# EAGLE design Mutatio_REV1 (EAGLE 7.2.0)
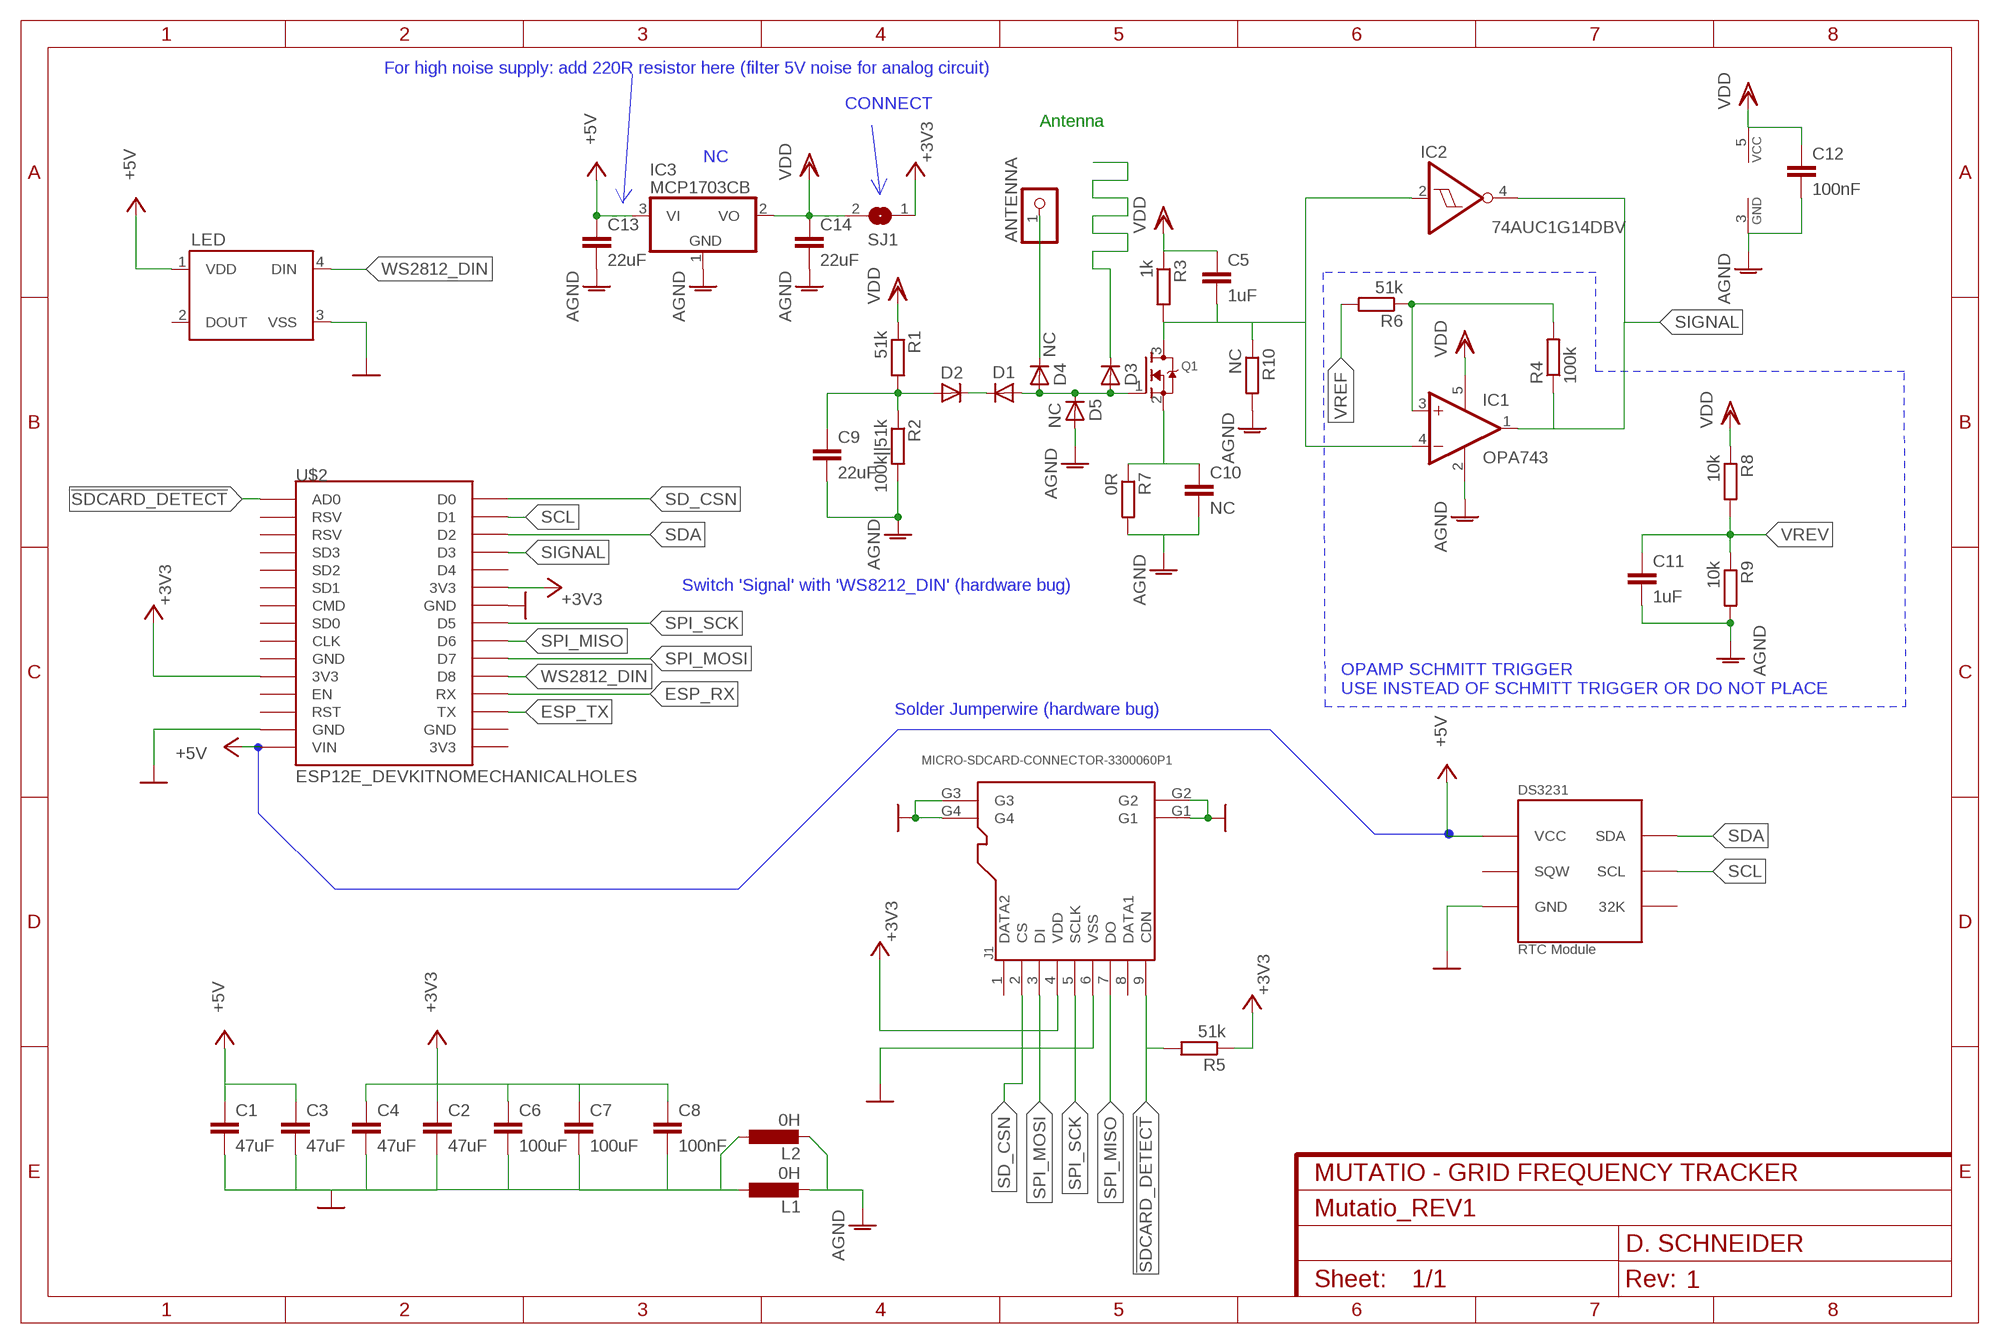
[diagram p0: schematic, sheet 1]
FRAME (FRAME-A4L): CNAME: MUTATIO - GRID FREQUENCY TRACKER; CREVISION: 1; DESIGNER: D. SCHNEIDER

## Parts
ANTENNA  PINHD-1X1CB  [1X01-CLEANBIG]
C1  47uF  C-EUC0805  [C0805]
C2  47uF  C-EUC0805  [C0805]
C3  47uF  C-EUC0805  [C0805]
C4  47uF  C-EUC0805  [C0805]
C5  1uF  C-EUC0603  [C0603]
C6  100uF  C-EUC1206  [C1206]
C7  100uF  C-EUC1206  [C1206]
C8  100nF  C-EUC0603  [C0603]
C9  22uF  C-EUC0603  [C0603]
C10  NC  C-EUC0603  [C0603]
C11  1uF  C-EUC0603  [C0603]
C12  100nF  C-EUC0603  [C0603]
C13  22uF  C-EUC0603  [C0603]
C14  22uF  C-EUC0603  [C0603]
D1  DIODE-MINIMELF  [MINIMELF]
D2  DIODE-MINIMELF  [MINIMELF]
D3  DIODE-MINIMELF  [MINIMELF]
D4  NC  DIODE-MINIMELF  [MINIMELF]
D5  NC  DIODE-MINIMELF  [MINIMELF]
IC1  OPA743  [SOT23-5]
IC2  74AUC1G14DBV  [SOT23-5]
IC3  MCP1703CB  [SOT23]
J1  MICRO-SDCARD-CONNECTOR-3300060P1  [9P-SMD-W-RING]
L1  0H  L-EUL2012C  [L2012C]
L2  0H  L-EUL2012C  [L2012C]
LED  WS2812B  [WS2812B]
Q1  MOSFET-NREFLOW  [SOT23]
R1  51k  R-EU_R0603  [R0603]
R2  100k||51k  R-EU_R0603  [R0603]
R3  1k  R-EU_R0603  [R0603]
R4  100k  R-EU_R0603  [R0603]
R5  51k  R-EU_R0603  [R0603]
R6  51k  R-EU_R0603  [R0603]
R7  0R  R-EU_R0603  [R0603]
R8  10k  R-EU_R0603  [R0603]
R9  10k  R-EU_R0603  [R0603]
R10  NC  R-EU_R0603  [R0603]
SJ1  SJ  [SJ]
U$1  DS3231_MODULEBIG_CONNECTER_ONLY  [DS3231_MODULE_BIGCON]
U$2  ESP12E_DEVKITNOMECHANICALHOLES  [ESP12E_DEVKIT_NOHOLES]

## Nets
!SDCARD_DETECT: J1.9(CDN) R5.2 U$2.AD0
+3V3: C2.1 C4.1 C6.1 C7.1 C8.1 J1.4(VDD) R5.1 SJ1.1 U$2.3V3@0(3V3) U$2.3V3@1(3V3)
+5V: C1.1 C3.1 C13.1 IC3.3(VI) LED.1(VDD) U$1.VCC@2(VCC) U$2.VIN
AGND: C9.2 C10.2 C11.2 C12.2 C13.2 C14.2 D5.A IC1.2(V-) IC2.3(GND) IC3.1(GND) L1.2 L2.2 R2.2 R7.2 R9.2 R10.2
ANTENNA: D1.A D3.A D4.A D5.C Q1.1(G)
BOARDANTENNA: D3.C
ESP_RX: U$2.RX
ESP_TX: U$2.TX
GND: C1.2 C2.2 C3.2 C4.2 C6.2 C7.2 C8.2 J1.6(VSS) J1.G1 J1.G2 J1.G3 J1.G4 L1.1 L2.1 LED.3(VSS) U$1.GND@2(GND) U$2.GND@1(GND) U$2.GND@2(GND)
N$1: D1.C D2.C
N$2: C10.1 Q1.2(S) R7.1
N$3: ANTENNA.1 D4.C
N$4: C5.2 IC1.4(-IN) IC2.2(I) Q1.3(D) R3.2 R10.1
N$7: IC1.3(+IN) R4.2 R6.1
REV1: C9.1 D2.A R1.2 R2.1
SCL: U$1.SCL@2(SCL) U$2.D1
SD_CSN: J1.2(CS) U$2.D0
SDA: U$1.SDA@2(SDA) U$2.D2
SIGNAL: IC1.1(OUT) IC2.4(O) R4.1 U$2.D3
SPI_MISO: J1.7(DO) U$2.D6
SPI_MOSI: J1.3(DI) U$2.D7
SPI_SCK: J1.5(SCLK) U$2.D5
VDD: C5.1 C12.1 C14.1 IC1.5(V+) IC2.5(VCC) IC3.2(VO) R1.1 R3.1 R8.1 SJ1.2
VREF: R6.2
VREV: C11.1 R8.2 R9.1
WS2812_DIN: LED.4(DIN) U$2.D8
Unconnected: J1.1(DATA2) J1.8(DATA1) LED.2(DOUT) U$1.32K U$1.SQW U$2.3V3@2(3V3) U$2.CLK U$2.CMD U$2.D4 U$2.EN U$2.GND@0(GND) U$2.GND@3(GND) U$2.RST U$2.RSV@0(RSV) U$2.RSV@1(RSV) U$2.SD0 U$2.SD1 U$2.SD2 U$2.SD3

## Notes on the sheet
- For high noise supply: add 220R resistor here (filter 5V noise for analog circuit)
- CONNECT
- Antenna
- NC
- Switch 'Signal' with 'WS8212_DIN' (hardware bug)
- OPAMP SCHMITT TRIGGER
  USE INSTEAD OF SCHMITT TRIGGER OR DO NOT PLACE
- Solder Jumperwire (hardware bug)

## Library data of the parts
ANTENNA = adafruit:PINHD-1X1: Pin header 1x1 for 0.1" spacing With round pins
C1-C14 = resistor:C-EU: CAPACITOR, European symbol
D1-D5 = diode:DIODE-: DIODE
IC1 = linear:OPA743: 12V, 7MHz, CMOS, Rail-to-Rail I/O OP AMP Source: http://focus.ti.com/lit/ds/sbos201/sbos201.pdf
IC2 = 74xx-little-de:74*1G14: Single Schmitt-Trigger Inverter Gate
IC3 = linear:MCP1703: 250 mA, 16V, Low Quiescent Current LDO Regulator Source: http://ww1.microchip.com/downloads/en/DeviceDoc/22049b.pdf
J1 = OPL Eagle Library:MICRO-SDCARD-CONNECTOR: Micro SD Card
L1 L2 = resistor:L-EU: INDUCTOR, European symbol
LED = SparkFun-LED:WS2812B: WS2812B - Intelligent control LED integrated light source Technical Specifications: Power Supply Voltage (VDD): 3.5 to 5.3 V Input Voltage (VI): -0.5 to VDD+0.5 V Operating Junction Temperature (Topt): -25°C to +80°C Storage Temperature Range (Tstg): -55°C to +150°C
Q1 = adafruit:MOSFET-N: N-Channel Mosfet 2N7002E - 60V 260mA SOT23 [Digikey: 2N7002ET1GOSTR-ND] - REEL BSH103 - 30V 850mA SOT23 [Digikey: 568-5013-1-ND]
R1-R10 = resistor:R-EU_: RESISTOR, European symbol
SJ1 = jumper:SJ: SMD solder JUMPER
U$1 = DS3231_Module:DS3231_MODULE
U$2 = NODEMCU_ESP12E_DEVKIT:ESP12E_DEVKIT: ESP12E DEVKIT BOARD

## Board
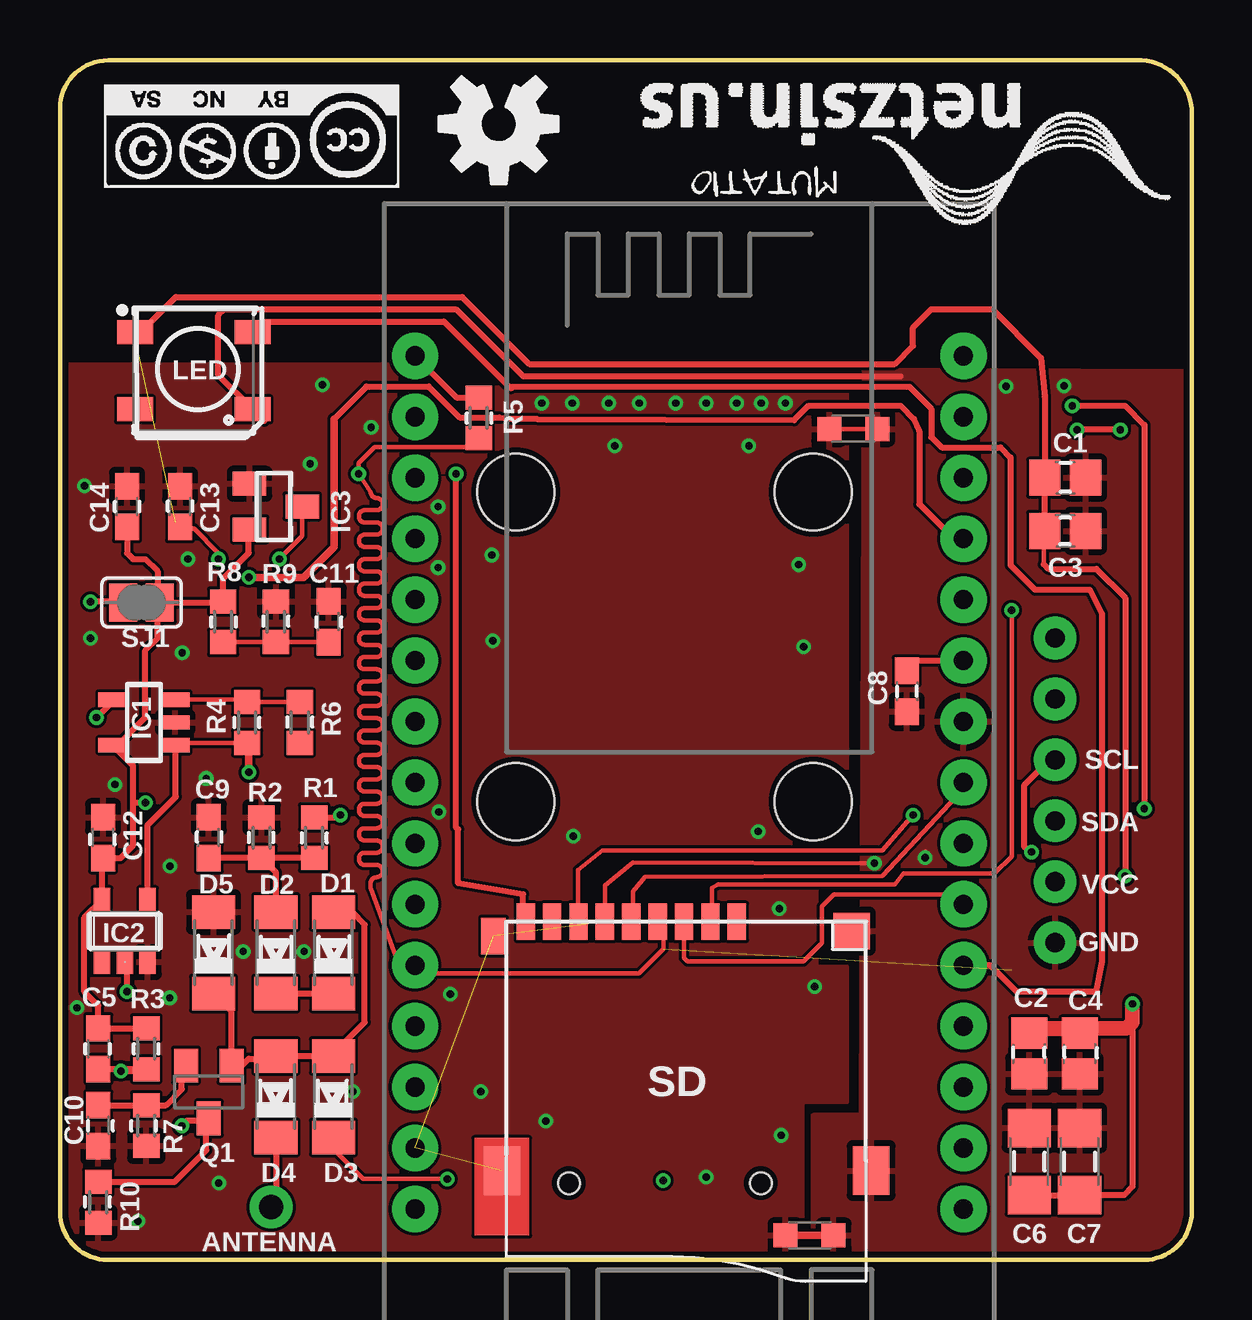
[diagram p1: board, top side]
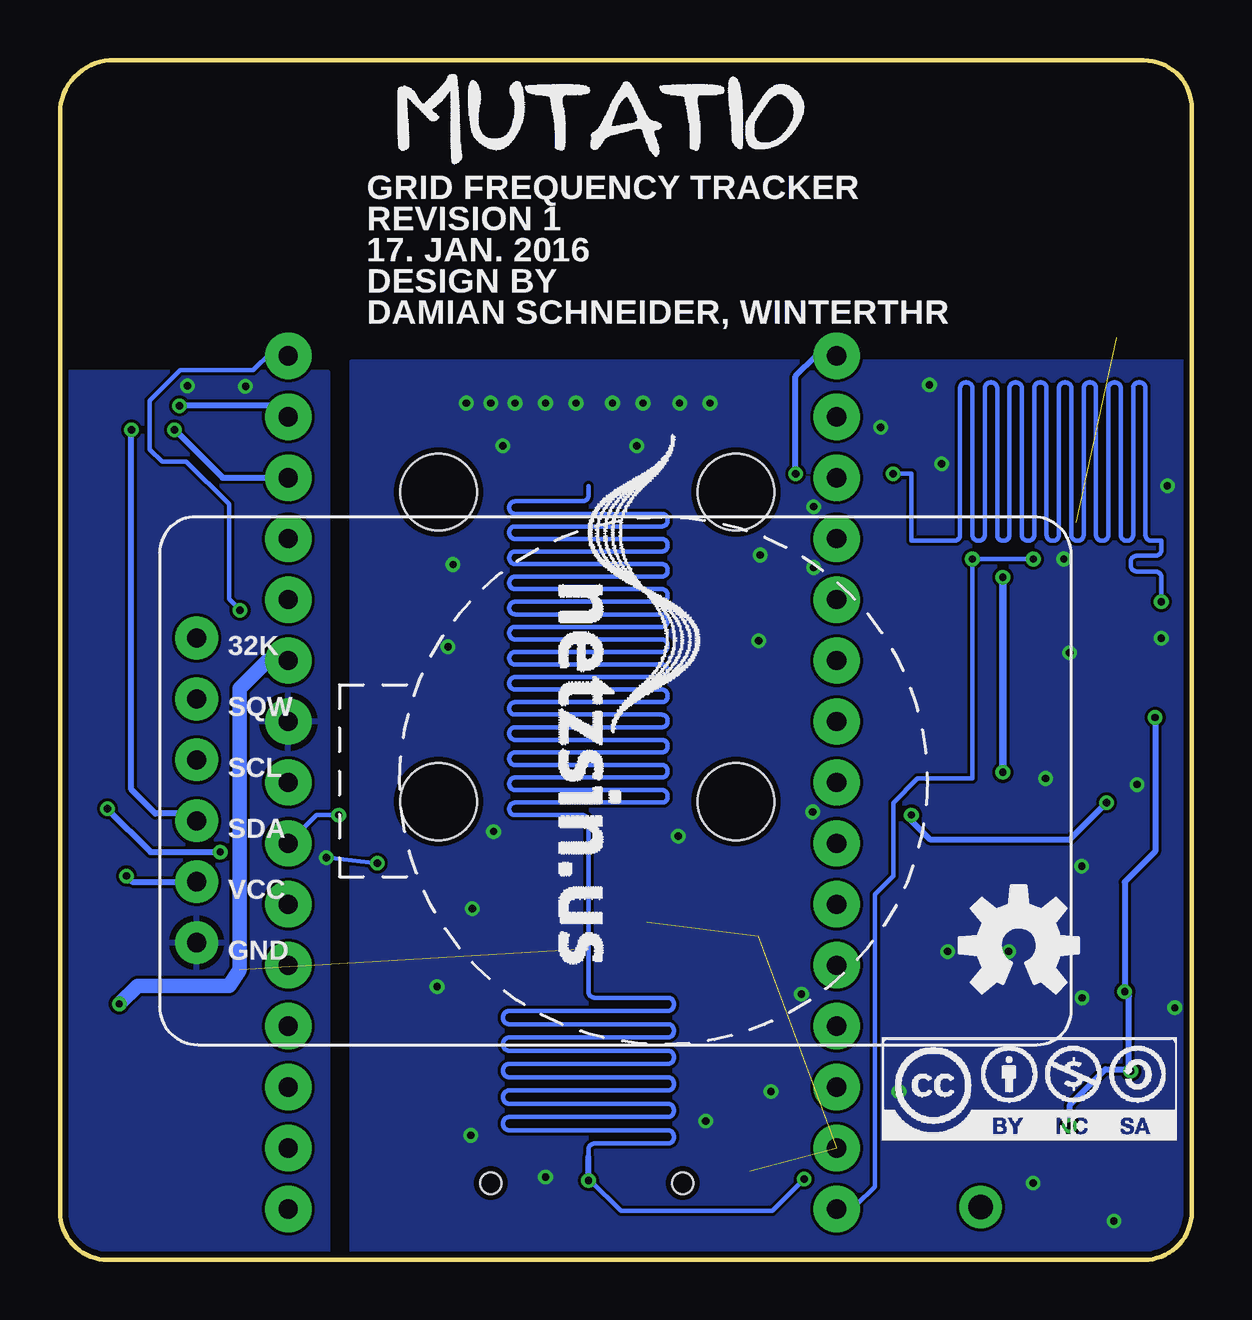
[diagram p2: board, bottom side, seen from below]

Size 47.18 x 50.01 mm. Coordinates in mm from the lower left corner, seen from the top.
Outline: 47.18,2 47.18,48 arc90 44.68,50 2,50 arc90 0,48 0,2 arc90 2,0 45.18,0 arc90 47.18,2
Copper layers (1*16): Top 0.035mm / dielectric 1.5mm / Bottom 0.035mm
Design rules "dirt_cheap_dirty_boards.v1": minimum track width 5mil, minimum drill 12mil, track to track 5mil, track to pad 5mil, pad to pad 5mil, via to via 5mil, smd to smd 0mil, copper to edge 10mil, drill to drill 10mil, minimum pad ring 10mil, minimum via ring 6mil, stop-mask expansion 2mil, vias tented up to drill 25mil, thermal gap 10mil
Holes 3.2 mm at 19,32 31.4,32 31.4,19.1 19,19.1

### Footprints (pad centres in the part's own frame; a part is rotated, then mirrored left to right if it is on the bottom)
1X01-CLEANBIG = drill 1.016 pad 1.778: 1 0,0
C0805 = smd 1.3 x 1.5: 1 -0.85,0; 2 0.85,0
C0603 = smd 1.1 x 1: 1 -0.85,0; 2 0.85,0
C1206 = smd 1.6 x 1.8: 1 -1.4,0; 2 1.4,0
MINIMELF = smd 1.4 x 1.8: A 1.7,0; C -1.7,0
SOT23-5 = smd 0.6 x 1.2: 1 -0.95,-1.306; 2 0,-1.306; 3 0.95,-1.306; 4 0.95,1.306; 5 -0.95,1.306
SOT23-5' = smd 0.69 x 0.99: 1 -0.95,-1.29; 2 0,-1.29; 3 0.95,-1.29; 4 0.95,1.3; 5 -0.95,1.3
SOT23 = smd 1 x 1.4: 1 -0.95,-1.1; 2 0.95,-1.1; 3 0,1.1
9P-SMD-W-RING = smd 1.524 x 0.762: 1 -7.493,2.114; 2 -7.493,1.014; 3 -7.493,-0.086; 4 -7.493,-1.186; 5 -7.493,-2.286; 6 -7.493,-3.386; 7 -7.493,-4.486; 8 -7.493,-5.586; 9 -7.493,-6.686 | smd 1.524 x 1.016: G1 -6.893,-8.032 | smd 2.032 x 1.524: G2 2.88,-7.686; G3 2.88,7.714 | smd 1.524 x 1.524: G4 -7.101,6.895 | hole 0.889: 3.407,-4.886; 3.407,3.114
L2012C = smd 1 x 1: 1 -1,0; 2 1,0
WS2812B = smd 1.5 x 1: 1 -2.45,1.6; 2 -2.45,-1.6; 3 2.45,-1.6; 4 2.45,1.6
R0603 = smd 1 x 1.1: 1 -0.85,0; 2 0.85,0
SJ = smd 1.168 x 1.6: 1 -0.762,0; 2 0.762,0
DS3231_MODULE_BIGCON = drill 0.8 pad 1.778: 32K 5.52,18.68; GND@2 -7.18,18.68; SCL@2 0.44,18.68; SDA@2 -2.1,18.68; SQW 2.98,18.68; VCC@2 -4.64,18.68
ESP12E_DEVKIT_NOHOLES = drill 0.8 pad 1.93: 3V3@0 -11.43,-7.62; 3V3@1 11.43,5.08; 3V3@2 11.43,-17.78; AD0 -11.43,17.78; CLK -11.43,-2.54; CMD -11.43,2.54; D0 11.43,17.78; D1 11.43,15.24; D2 11.43,12.7; D3 11.43,10.16; D4 11.43,7.62; D5 11.43,0; D6 11.43,-2.54; D7 11.43,-5.08; D8 11.43,-7.62; EN -11.43,-10.16; GND@0 -11.43,-5.08; GND@1 -11.43,-15.24; GND@2 11.43,2.54; GND@3 11.43,-15.24; RST -11.43,-12.7; RSV@0 -11.43,15.24; RSV@1 -11.43,12.7; RX 11.43,-10.16; SD0 -11.43,0; SD1 -11.43,5.08; SD2 -11.43,7.62; SD3 -11.43,10.16; TX 11.43,-12.7; VIN -11.43,-17.78

### Placement (x,y rotation side)
ANTENNA  8.8,2.2 0 top
C1  41.9,32.6 0 top
C2  40.4,8.6 270 top
C3  41.9,30.38 0 top
C4  42.5,8.6 270 top
C5  1.6,8.8 270 top
C6  40.4,4.1 90 top
C7  42.5,4.1 90 top
C8  35.3,23.7 270 top
C9  6.2,17.6 90 top
C10  1.6,5.6 270 top
C11  11.2,26.6 90 top
C12  1.8,17.6 90 top
C13  5,31.4 90 top
C14  2.8,31.4 90 top
D1  11.4,12.8 90 top
D2  9,12.8 90 top
D3  11.4,6.8 90 top
D4  9,6.8 90 top
D5  6.4,12.8 90 top
IC1  3.5,22.4 90 top
IC2  74AUC1G14DBV  [SOT23-5']  2.7,13.7 0 top
IC3  9,31.4 270 top
J1  26.1,6.6 270 top
L1  33.07,34.64 180 top
L2  31.24,1.02 180 top
LED  5.58,37.06 0 top
Q1  6.2,7 180 top
R1  10.6,17.6 270 top
R2  8.4,17.6 90 top
R3  3.6,8.8 270 top
R4  7.8,22.4 90 top
R5  17.45,35.1 90 top
R6  10,22.4 270 top
R7  3.6,5.6 270 top
R8  6.8,26.6 270 top
R9  9,26.6 90 top
R10  1.6,2.4 270 top
SJ1  3.4,27.4 0 top
U$1  22.8,20.4 90 bottom
U$2  26.23,19.9 0 top
U$3  [OSHW-LOGO-M]  18.29,47.35 180 top
U$4  [CC-BY-NC-SA]  14.12,48.97 180 top
U$5  [CC-BY-NC-SA]  12.9,4.99 0 bottom
U$6  [OSHW-LOGO-M]  7.21,13.11 0 bottom

### Tracks (layer width: path | path; a pad name or v marks a point on that pad's centre or on a via)
!SDCARD_DETECT  (via drill 0.3)
  Top 0.178: 14.89,37.59 U$2.AD0
  Top 0.254: 14.89,37.59 16.53,35.95 R5.2 | J1.9 19.3,14.2 19.3,15.24 16.6,15.7 16.6,17.94 16.51,18.03 v16.51,32.77
  Bottom 0.254: v16.51,32.77 16.51,36.83 15.66,37.68 U$2.AD0
+3V3  (via drill 0.3)  (1 unrouted)
  Top 0.178: U$2.3V3@0 14.8,11.94 24.13,11.94 25.15,12.95 25.15,13.86 J1.4 | U$2.3V3@0 15.07,12.28 | U$2.3V3@0 14.14,12.28 12.95,15.49 12.95,15.7 arc-90 13.2,15.95 arc90 13.45,16.2 13.45,16.21 arc90 13.2,16.46 12.71,16.46 arc-90 12.46,16.71 12.46,16.72 arc-90 12.71,16.97 13.2,16.97 arc90 13.45,17.22 13.45,17.23 arc90 13.2,17.48 12.71,17.48 arc-90 12.46,17.73 12.46,17.74 arc-90 12.71,17.99 13.2,17.99 arc90 13.45,18.24 13.45,18.25 arc90 13.2,18.5 12.71,18.5 arc-90 12.46,18.75 12.46,18.76 arc-90 12.71,19.01 13.2,19.01 arc90 13.45,19.26 13.45,19.27 arc90 13.2,19.52 12.71,19.52 arc-90 12.46,19.77 12.46,19.78 arc-90 12.71,20.03 13.2,20.03 arc90 13.45,20.28 13.45,20.29 arc90 13.2,20.54 12.71,20.54 arc-90 12.46,20.79 12.46,20.8 arc-90 12.71,21.05 13.2,21.05 arc90 13.45,21.3 13.45,21.31 arc90 13.2,21.56 12.71,21.56 arc-90 12.46,21.81 12.46,21.82 arc-90 12.71,22.07 13.2,22.07 arc90 13.45,22.32 13.45,22.33 arc90 13.2,22.58 12.71,22.58 arc-90 12.46,22.83 12.46,22.84 arc-90 12.71,23.09 13.2,23.09 arc90 13.45,23.34 13.45,23.35 arc90 13.2,23.6 12.71,23.6 arc-90 12.46,23.85 12.46,23.86 arc-90 12.71,24.11 13.2,24.11 arc90 13.45,24.36 13.45,24.37 arc90 13.2,24.62 12.71,24.62 arc-90 12.46,24.87 12.46,24.88 arc-90 12.71,25.13 13.2,25.13 arc90 13.45,25.38 13.45,25.39 arc90 13.2,25.64 12.71,25.64 arc-90 12.46,25.89 12.46,25.9 arc-90 12.71,26.15 13.2,26.15 arc90 13.45,26.4 13.45,26.41 arc90 13.2,26.66 12.71,26.66 arc-90 12.46,26.91 12.46,26.92 arc-90 12.71,27.17 13.2,27.17 arc90 13.45,27.41 13.45,27.43 arc90 13.2,27.68 12.71,27.68 arc-90 12.46,27.93 12.46,27.94 arc-90 12.71,28.19 13.2,28.19 arc90 13.45,28.43 13.45,28.45 arc90 13.2,28.7 12.71,28.7 arc-90 12.46,28.95 12.46,28.96 arc-90 12.71,29.21 13.2,29.21 arc90 13.45,29.45 13.45,29.47 arc90 13.2,29.72 12.71,29.72 arc-90 12.46,29.96 12.46,29.98 arc-90 12.71,30.23 13.2,30.23 arc90 13.45,30.47 13.45,30.49 arc90 13.2,30.74 12.71,30.74 arc-90 12.46,30.98 12.46,31 arc-90 12.71,31.25 13.2,31.25 arc90 13.45,31.49 13.45,31.51 arc90 13.2,31.76 arc-90 12.95,32 v12.45,32.77 12.45,33.21 13.12,33.88 17.08,33.88 R5.1
  Top 0.254: SJ1.1 2.64,27.43 v1.27,27.43 | 42.7,9.65 C4.1 C2.1 40.6,9.65 42.7,9.65 | 42.7,9.65 44.45,9.65 44.7,9.65 44.7,3.05 44.36,2.7 C7.1 C6.1 | C8.1 35.73,24.98 U$2.3V3@1
  Top 0.61: 40.6,9.65 44.45,9.65 44.7,9.91 v44.7,10.67
  Bottom 0.178: v1.27,27.43 1.27,28.45 arc-90 1.52,28.7 2.29,28.7 arc90 2.54,28.94 2.54,29.1 arc90 2.29,29.35 1.52,29.35 arc-90 1.27,29.6 1.27,29.97 1.68,29.97 arc90 1.93,30.22 1.93,36.33 arc-90 2.18,36.58 2.2,36.58 arc-90 2.44,36.33 2.44,30.22 arc90 2.69,29.97 2.71,29.97 arc90 2.96,30.22 2.96,36.33 arc-90 3.21,36.58 3.23,36.58 arc-90 3.47,36.33 3.47,30.22 arc90 3.72,29.97 3.74,29.97 arc90 3.99,30.22 3.99,36.33 arc-90 4.24,36.58 4.26,36.58 arc-90 4.5,36.33 4.5,30.22 arc90 4.75,29.97 4.77,29.97 arc90 5.02,30.22 5.02,36.33 arc-90 5.27,36.58 5.29,36.58 arc-90 5.54,36.33 5.54,30.22 arc90 5.78,29.97 5.8,29.97 arc90 6.05,30.22 6.05,36.33 arc-90 6.3,36.58 6.32,36.58 arc-90 6.57,36.33 6.57,30.22 arc90 6.81,29.97 6.83,29.97 arc90 7.08,30.22 7.08,36.33 arc-90 7.33,36.58 7.35,36.58 arc-90 7.6,36.33 7.6,30.22 arc90 7.84,29.97 7.87,29.97 arc90 8.11,30.22 8.11,36.33 arc-90 8.36,36.58 8.38,36.58 arc-90 8.63,36.33 8.63,30.22 arc90 8.88,29.97 8.89,29.97 arc90 9.14,30.22 9.14,36.33 arc-90 9.39,36.58 9.41,36.58 arc-90 9.66,36.33 9.66,30.22 arc90 9.91,29.97 11.68,29.97 11.68,32.77 v12.45,32.77
  Bottom 0.61: v44.7,10.67 43.94,11.43 40.13,11.43 39.68,12.08 39.68,23.82 38.52,24.98 U$2.3V3@1
+5V  (via drill 0.3)  (1 unrouted)
  Top 0.178: IC3.3 10.1,30.17 v9.14,29.21 | v6.6,29.21 6.6,29.46 5.59,30.48 5.07,30.48 C13.1 | C3.1 41,30.33 41,29
  Top 0.254: 4.82,30.73 C13.1 | 3.5,38.66 LED.1 3.13,38.44 4.83,40.13 16.76,40.13 19.56,37.34 34.8,37.34 35.56,38.1 35.56,38.86 36.32,39.62 38.86,39.62 40.89,37.59 41.05,35.97 C1.1 C3.1 | 41,29 41.2,28.8 43.2,28.8 44.4,27.6 v44.4,16
  Bottom 0.178: v6.6,29.21 v9.14,29.21 9.14,20.07 11.43,20.07 12.45,19.05 12.45,16 13.21,15.24 13.21,3.05 13.97,2.29 14.63,2.29 U$2.VIN
  Bottom 0.254: v44.4,16 44.16,15.76 U$1.VCC@2
AGND  (via drill 0.3)
  other vias: 5.33,29.21 1.27,25.91 2.29,19.81 6.1,20.07 4.57,10.92 0.71,10.51 1.02,32.26 3.25,1.62 20.08,35.71 21.35,35.71 22.87,35.71 24.14,35.71 25.67,35.71 26.94,35.71 28.21,35.71 29.22,35.71 30.24,35.71 16.27,11.08 18.05,25.81 23.13,33.94 28.72,33.94 30.79,28.98 31,25.55 29.99,14.63 17.99,29.38 15.76,31.4 15.76,28.86 12.97,34.7 10.94,36.48 10.43,33.17 10.17,12.85 7.63,12.85 4.59,16.41 5.09,25.3 6.62,3.2 12.21,7.01 17.54,7.01 26.94,3.46 31.46,11.39 15.8,18.67 30.06,5.19 20.26,5.79 29.1,17.85 21.4,17.65
  pour Top: 0.2,37.3 30.9,37.3 32.51,37.34 32.77,37.34 32.77,17.78 31.5,17.78 31.5,12.19 32.77,12.19 32.77,6.6 30.9,6.6 30.9,0 0,0
  pour Bottom: 0,37.4 35,37.4 35,0 0,0
ANTENNA
  Top 0.254: D1.A 11.42,14.48 12.19,14.48 12.7,13.97 12.7,9.91 11.4,8.61 D3.A D4.A 8.88,8.38 7.87,8.38 7.59,8.1 Q1.1 7.15,10.35 D5.C
BOARDANTENNA  (via drill 0.3)
  Top 0.178: D3.C 11.4,4.6 12.63,3.37 v16.15,3.37
  Bottom 0.178: 25.15,32.26 25.15,31.87 arc90 25.39,31.62 28.2,31.62 arc-90 28.45,31.37 28.45,31.34 arc-90 28.2,31.09 22.09,31.09 arc90 21.84,30.85 21.84,30.82 arc90 22.09,30.57 28.2,30.57 arc-90 28.45,30.32 28.45,30.3 arc-90 28.2,30.05 22.09,30.05 arc90 21.84,29.8 21.84,29.77 arc90 22.09,29.52 28.2,29.52 arc-90 28.45,29.28 28.45,29.25 arc-90 28.2,29 22.09,29 arc90 21.84,28.75 21.84,28.73 arc90 22.09,28.48 28.2,28.48 arc-90 28.45,28.23 28.45,28.2 arc-90 28.2,27.95 22.09,27.95 arc90 21.84,27.71 21.84,27.68 arc90 22.09,27.43 28.2,27.43 arc-90 28.45,27.18 28.45,27.16 arc-90 28.2,26.91 22.09,26.91 arc90 21.84,26.66 21.84,26.63 arc90 22.09,26.39 28.2,26.39 arc-90 28.45,26.14 28.45,26.11 arc-90 28.2,25.86 22.09,25.86 arc90 21.84,25.61 21.84,25.59 arc90 22.09,25.34 28.2,25.34 arc-90 28.45,25.09 28.45,25.06 arc-90 28.2,24.82 22.09,24.82 arc90 21.84,24.57 21.84,24.54 arc90 22.09,24.29 28.2,24.29 arc-90 28.45,24.05 28.45,24.02 arc-90 28.2,23.77 22.09,23.77 arc90 21.84,23.52 21.84,23.49 arc90 22.09,23.25 28.2,23.25 arc-90 28.45,23 28.45,22.97 arc-90 28.2,22.72 22.09,22.72 arc90 21.84,22.48 21.84,22.45 arc90 22.09,22.2 28.2,22.2 arc-90 28.45,21.95 28.45,21.92 arc-90 28.2,21.68 22.09,21.68 arc90 21.84,21.43 21.84,21.4 arc90 22.09,21.15 28.2,21.15 arc-90 28.45,20.91 28.45,20.88 arc-90 28.2,20.63 22.09,20.63 arc90 21.84,20.38 21.84,20.35 arc90 22.09,20.11 28.2,20.11 arc-90 28.45,19.86 28.45,19.83 arc-90 28.2,19.58 22.09,19.58 arc90 21.84,19.34 21.84,19.31 arc90 22.09,19.06 28.2,19.06 arc-90 28.45,18.81 28.45,18.78 arc-90 28.2,18.54 25.39,18.54 arc90 25.15,18.29 25.15,11.18 arc-90 24.9,10.93 21.84,10.93 arc90 21.59,10.68 21.59,10.62 arc90 21.84,10.38 28.45,10.38 arc-90 28.7,10.13 28.7,10.07 arc-90 28.45,9.82 21.84,9.82 arc90 21.59,9.57 21.59,9.52 arc90 21.84,9.27 28.45,9.27 arc-90 28.7,9.02 28.7,8.96 arc-90 28.45,8.72 21.84,8.72 arc90 21.59,8.47 21.59,8.41 arc90 21.84,8.16 28.45,8.16 arc-90 28.7,7.92 28.7,7.86 arc-90 28.45,7.61 21.84,7.61 arc90 21.59,7.36 21.59,7.31 arc90 21.84,7.06 28.45,7.06 arc-90 28.7,6.81 28.7,6.75 arc-90 28.45,6.51 21.84,6.51 arc90 21.59,6.26 21.59,6.2 arc90 21.84,5.95 28.45,5.95 arc-90 28.7,5.71 28.7,5.65 arc-90 28.45,5.4 21.84,5.4 arc90 21.59,5.15 21.59,5.1 arc90 21.84,4.85 24.9,4.85 arc-90 25.15,4.6 25.15,4.28
  Bottom 0.178: v16.15,3.37 17.47,2.05 23.8,2.05 25.05,3.3 v25.15,3.3
  Bottom 0.254: v25.15,3.3 25.15,4.28
GND  (via drill 0.3)  (3 unrouted)
  Top 0.178: J1.6 22.71,15.6 23.88,16.56 v33.95,16.53 | v36.07,16.76 36.07,17.02
  Top 0.254: 8.52,34.97 LED.3 6.6,36.89 6.6,39.37 6.86,39.62 16.51,39.62 19.3,36.83 35.05,36.83
  Bottom 0.178: v33.95,16.53 v36.07,16.76
  other vias: 39.44,36.41 41.86,36.43
  pour Top: 31.4,6 31.4,0 47,0 47,37 33.54,37.06 33.4,6
  pour Bottom: 36,37 36,0 47,0 47,37
N$1
  Top 0.254: D2.C D1.C
N$2
  Top 0.254: C10.1 R7.1 4.42,6.45 5.08,7.11 5.08,7.93 Q1.2
N$3
  Top 0.254: D4.C 9,2.4 ANTENNA.1
N$4  (via drill 0.3)
  Top 0.254: R10.1 4.77,3.25 6.1,4.57 6.1,5.8 | 6.1,5.8 Q1.3 | 6.1,5.8 5.29,5.8 v5.08,5.59 | v2.54,7.87 3.52,7.87 R3.2 C5.2 | v2.79,11.18 2.79,12.32 IC2.2 | IC1.4 2.19,23.28 v1.52,22.61
  Bottom 0.254: v5.08,5.59 5.08,6.47 R3.2 2.62,7.95 | 2.62,7.95 v2.54,7.87 | 2.62,7.95 2.62,11 v2.79,11.18 2.79,15.75 1.52,17.02 v1.52,22.61
N$6
  Top 0.178: 32.26,34.64 34.04,34.64
N$7
  Top 0.178: R6.1 R4.2 7.7,23.35 IC1.3
N$8
  Top 0.305: 30.48,1.02 32,1.02
REV1
  Top 0.254: D2.A 9,16.15 R2.1 | R2.1 C9.1 | R1.2 R2.1
SCL  (via drill 0.3)
  Top 0.254: v42.2,35.6 44.4,35.6 45.2,34.8 v45.2,18.8 | v40.5,17 40.2,17.2 40.2,19.8 41.24,20.84 U$1.SCL@2
  Bottom 0.254: U$2.D1 38.12,35.6 v42.2,35.6 | v45.2,18.8 43.4,17 v40.5,17
SD_CSN  (via drill 0.3)
  Top 0.178: J1.2 27.18,14.16 27.18,15.49 27.43,15.65 34.8,15.65 35.15,16.1 38.95,16.1 39.67,16.82 v39.67,27.08
  Bottom 0.178: v39.67,27.08 40.13,27.54 40.13,31.5 41.91,33.27 42.93,33.27 43.43,33.78 43.43,35.81 42.16,37.08 39.12,37.08 38.35,37.85 37.85,37.85 37.76,37.68 U$2.D0
SDA  (via drill 0.3)
  Top 0.254: v44.2,34.6 v42.4,34.6
  Bottom 0.254: U$1.SDA@2 41.78,18.6 43.2,18.6 44.2,19.6 v44.2,34.6 | v42.4,34.6 40.4,32.6 U$2.D2
SIGNAL  (via drill 0.3)
  Top 0.178: R4.1 4.91,21.55 IC1.1
  Top 0.254: IC2.4 3.65,18.13 4.83,19.3 4.83,21.43 IC1.1 | 11.43,35.05 12.78,36.4 15.37,36.4 16.66,35.11 18.31,35.11 18.77,35.06 19.87,35.06 19.88,35.05 30.6,35 31.2,35.6 35.05,35.6 35.6,35.05 35.81,34.54 35.81,31.5 37.25,30.06 U$2.D3
  Top 0.305: R4.1 7.87,21.48 v7.87,20.32 | v7.87,28.45 10.16,28.45 11.43,29.72 11.43,35.05
  Bottom 0.305: v7.87,20.32 v7.87,28.45
SPI_MISO  (via drill 0.3)
  Top 0.178: v35.56,18.54 34.29,17.07 22.61,17.07 21.59,16.26 21.59,14.12 J1.7
  Bottom 0.178: U$2.D6 36.48,18.54 v35.56,18.54
SPI_MOSI
  Top 0.178: J1.3 26.01,12.59 26.16,12.45 30.99,12.45 31.75,13.21 31.75,14.73 32.26,15.24 37.24,15.24 U$2.D7
SPI_SCK
  Top 0.178: U$2.D5 37.66,19.63 34.28,16.01 24.38,15.96 23.88,15.35 23.88,14.15 J1.5
VDD  (via drill 0.3)
  Top 0.254: R3.1 C5.1 1.6,10.59 1.02,11.18 1.02,14.27 IC2.5 1.75,16.7 C12.1 2.53,16.75 3.05,17.27 3.05,19.05 | 3.05,19.05 3.05,20.6 IC1.5 2.4,21.45 3.56,22.61 3.56,25.4 4.06,25.91 4.06,27.3 SJ1.2 | SJ1.2 6.75,27.4 R8.1 6.8,28.39 7.87,29.46 7.87,30.42 IC3.2 | C14.1 2.8,29.46 3.05,29.21 3.56,29.21 4.06,28.7 4.06,27.5 SJ1.2 | R1.1 11.59,18.45 v11.68,18.54 | v3.56,19.05 3.05,19.05
  Bottom 0.254: v11.68,18.54 11.68,18.29 10.92,17.53 5.08,17.53 v3.56,19.05
VREV
  Top 0.178: R8.2 R9.1 C11.1
WS2812_DIN
  Top 0.254: LED.4 8.49,39.12 16,39.12 18.8,36.32 18.86,36.39 35.41,36.39 36.32,35.48 36.32,34.29 36.75,33.86 39.21,33.86 39.62,33.45 39.62,28.96 40.64,27.94 42.93,27.94 43.43,26.92 43.43,12.45 43.18,11.18 39.88,11.18 38.77,12.28 U$2.D8
(copper drawn outside any net)
  shapes: Top area x1

### Text on the board
tNames: SCL | SDA | VCC | GND | SD
bNames: GRID FREQUENCY TRACKER | REVISION 1 | 17. JAN. 2016 | DESIGN BY | DAMIAN SCHNEIDER, WINTERTHR